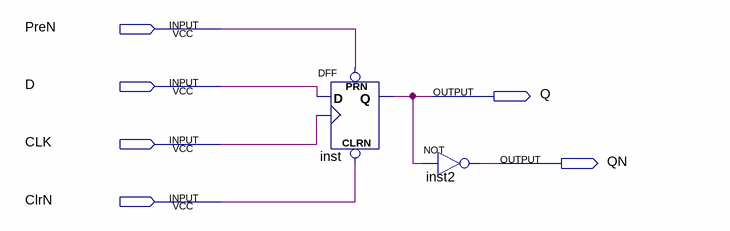
[diagram p0: schematic sheet]
// Quartus schematic DFF_1.bdf as structural Verilog: 2 symbols, 6 pins
module DFF_1 (
  input  PreN,
  input  D,
  input  CLK,
  input  ClrN,
  output Q,
  output QN
);

  DFF inst (.CLRN(ClrN), .CLK(CLK), .D(D), .PRN(PreN), .Q(Q));
  not inst2 (QN, Q);
endmodule
